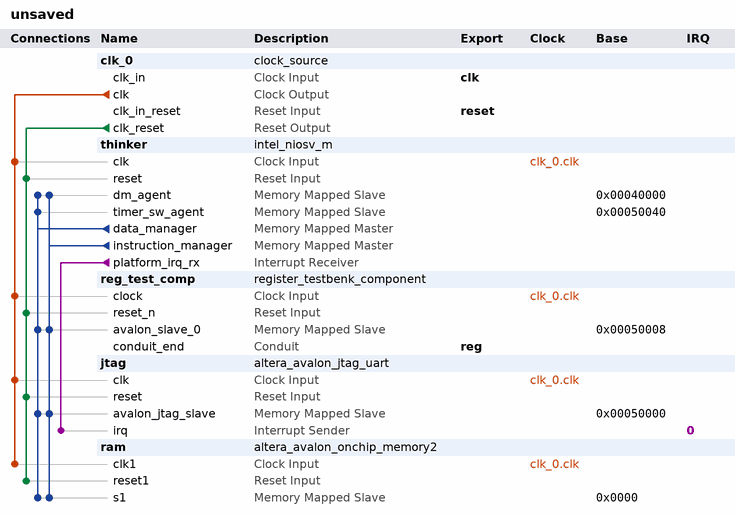
[diagram p0: system contents]
# Platform Designer (Qsys) system unsaved, Cyclone IV E EP4CE115F29C7
# Parameters at their usual value, and those the tool derives, are not listed.
package require -exact qsys 24.1
create_system unsaved
set_project_property DEVICE_FAMILY {Cyclone IV E}
set_project_property DEVICE EP4CE115F29C7

add_instance clk_0 clock_source 24.1
set_instance_parameter_value clk_0 clockFrequency 50000000

add_instance thinker intel_niosv_m 26.0.0
set_instance_parameter_value thinker enableAvalonInterface false
set_instance_parameter_value thinker enableDebugReset false
set_instance_parameter_value thinker enableECCLite false
set_instance_parameter_value thinker hartId 0
set_instance_parameter_value thinker interruptMode 0
set_instance_parameter_value thinker pipelineArch true
set_instance_parameter_value thinker resetSlave Absolute

add_instance reg_test_comp register_testbenk_component 1.0

add_instance jtag altera_avalon_jtag_uart 24.1
set_instance_parameter_value jtag simInteractiveOptions NO_INTERACTIVE_WINDOWS

add_instance ram altera_avalon_onchip_memory2 24.1
set_instance_parameter_value ram dataWidth 32
set_instance_parameter_value ram dualPort false
set_instance_parameter_value ram initMemContent true
set_instance_parameter_value ram initializationFileName onchip_mem.hex
set_instance_parameter_value ram memorySize 262144

# connections
add_connection clk_0.clk jtag.clk clock
add_connection clk_0.clk ram.clk1 clock
add_connection clk_0.clk reg_test_comp.clock clock
add_connection clk_0.clk thinker.clk clock
add_connection clk_0.clk_reset jtag.reset reset
add_connection clk_0.clk_reset ram.reset1 reset
add_connection clk_0.clk_reset reg_test_comp.reset_n reset
add_connection clk_0.clk_reset thinker.reset reset
add_connection thinker.data_manager jtag.avalon_jtag_slave avalon
set_connection_parameter_value thinker.data_manager/jtag.avalon_jtag_slave baseAddress 0x00050000
add_connection thinker.data_manager ram.s1 avalon
set_connection_parameter_value thinker.data_manager/ram.s1 baseAddress 0x0000
add_connection thinker.data_manager reg_test_comp.avalon_slave_0 avalon
set_connection_parameter_value thinker.data_manager/reg_test_comp.avalon_slave_0 baseAddress 0x00050008
add_connection thinker.data_manager thinker.dm_agent avalon
set_connection_parameter_value thinker.data_manager/thinker.dm_agent baseAddress 0x00040000
add_connection thinker.data_manager thinker.timer_sw_agent avalon
set_connection_parameter_value thinker.data_manager/thinker.timer_sw_agent baseAddress 0x00050040
add_connection thinker.instruction_manager jtag.avalon_jtag_slave avalon
set_connection_parameter_value thinker.instruction_manager/jtag.avalon_jtag_slave baseAddress 0x00050000
add_connection thinker.instruction_manager ram.s1 avalon
set_connection_parameter_value thinker.instruction_manager/ram.s1 baseAddress 0x0000
add_connection thinker.instruction_manager reg_test_comp.avalon_slave_0 avalon
set_connection_parameter_value thinker.instruction_manager/reg_test_comp.avalon_slave_0 baseAddress 0x00050008
add_connection thinker.instruction_manager thinker.dm_agent avalon
set_connection_parameter_value thinker.instruction_manager/thinker.dm_agent baseAddress 0x00040000
add_connection thinker.platform_irq_rx jtag.irq interrupt
set_connection_parameter_value thinker.platform_irq_rx/jtag.irq irqNumber 0

# exported interfaces
add_interface clk clock sink
set_interface_property clk EXPORT_OF clk_0.clk_in
add_interface reg conduit end
set_interface_property reg EXPORT_OF reg_test_comp.conduit_end
add_interface reset reset sink
set_interface_property reset EXPORT_OF clk_0.clk_in_reset

set_interconnect_requirement {$system} qsys_mm.clockCrossingAdapter HANDSHAKE
set_interconnect_requirement {$system} qsys_mm.enableEccProtection FALSE
set_interconnect_requirement {$system} qsys_mm.insertDefaultSlave FALSE
set_interconnect_requirement {$system} qsys_mm.maxAdditionalLatency 1

save_system unsaved.qsys
